# Altium schematic sheet 03_External_Storage_Interface.SchDoc: Mainboard External Storage
size A3; SheetNumber: 7; SheetTotal: 13
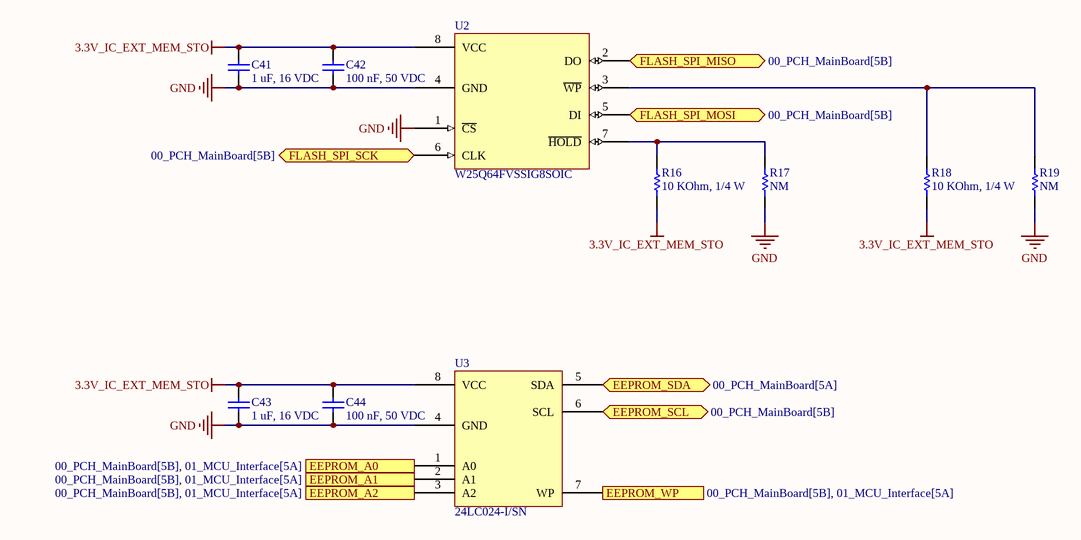
[diagram p0: 03_External_Storage_Interface.SchDoc]

## Parts
C41  1 uF, 16 VDC  [CAP_0603]
C42  100 nF, 50 VDC  [CAP_0603]
C43  1 uF, 16 VDC  [CAP_0603]
C44  100 nF, 50 VDC  [CAP_0603]
R16  10 KOhm, 1/4 W  [resistor_0603]
R17  NM  [resistor_0603]
R18  10 KOhm, 1/4 W  [resistor_0603]
R19  NM  [resistor_0603]
U2  W25Q64FVSSIG8SOIC  [W25Qxx8SOIC]
U3  24LC024-I/SN  [24LCxxx-I/SN]

## Ports
EEPROM_A0 (in, see 00_PCH_MainBoard[5B], 01_MCU_Interface[5A]), EEPROM_A1 (in, see 00_PCH_MainBoard[5B], 01_MCU_Interface[5A]), EEPROM_A2 (in, see 00_PCH_MainBoard[5B], 01_MCU_Interface[5A]), EEPROM_SCL (bidir, see 00_PCH_MainBoard[5B]), EEPROM_SDA (bidir, see 00_PCH_MainBoard[5A]), EEPROM_WP (in, see 00_PCH_MainBoard[5B], 01_MCU_Interface[5A]), FLASH_SPI_MISO (bidir, see 00_PCH_MainBoard[5B]), FLASH_SPI_MOSI (bidir, see 00_PCH_MainBoard[5B]), FLASH_SPI_SCK (bidir, see 00_PCH_MainBoard[5B])

## Nets
3.3V_IC_EXT_MEM_STO: C41.2 C42.2 C43.2 C44.2 R16.1 R18.1 U2.8(VCC) U3.8(VCC)
GND: C41.1 C42.1 C43.1 C44.1 R17.1 R19.1 U2.1(~{CS}) U2.4(GND) U3.4(GND)
EEPROM_A0: U3.1(A0) ; port EEPROM_A0
EEPROM_A1: U3.2(A1) ; port EEPROM_A1
EEPROM_A2: U3.3(A2) ; port EEPROM_A2
EEPROM_SCL: U3.6(SCL) ; port EEPROM_SCL
EEPROM_SDA: U3.5(SDA) ; port EEPROM_SDA
EEPROM_WP: U3.7(WP) ; port EEPROM_WP
FLASH_SPI_MISO: U2.2(DO) ; port FLASH_SPI_MISO
FLASH_SPI_MOSI: U2.5(DI) ; port FLASH_SPI_MOSI
FLASH_SPI_SCK: U2.6(CLK) ; port FLASH_SPI_SCK
NetR16_2: R16.2 R17.2 U2.7(~{HOLD})
NetR18_2: R18.2 R19.2 U2.3(~{WP})

## Notes on the sheet
- APPROVALS
- DATE
- PROJECT
- BOM:
- REFERENCE DOCUMENTS
- TITLE
- PROJECT REVISION
- DOCUMENT REVISION
- ASSY DWG:
- FAB DWG:
- PCB DWG:
- SIZE:
- A3
- FILE NAME:
- REV
- SHEET
- OF

## Library data of the parts
C41 C43 = 0106031051016: CAP, size 0603, 1 uF, 16 VDC; Manufacture Name: Samsung Electro-Mechanics; Manufacture SN: CL10B105KO8NNWC; Capacitance: 1 uF; Tolerance: +/-10%; Voltage Rating DC: 16 VDC; ComponentLink2Description: Datasheet; ComponentLink2URL: https://www.mouser.vn/datasheet/2/585/Samsung_MLCC_1837944-1929650.pdf; Operating Temperature: -55 to +125degC; Packaging: Tape and Reel; Mounting Technology: SMT; Size: 0603; Supplier 1 Name: Mouser; Supplier 1 SN: 187-CL10B105KO8NNWC; Supplier 1 URL: https://www.mouser.vn/ProductDetail/Samsung-Electro-Mechanics/CL10B105KO8NNWC?qs=81r%252BiQLm7BT%252BXtc72qn1ug%3D%3D&utm_source=mouser-refine-download&utm_medium=file&utm_campaign=CL10B105KO8NNWC&utm_content=Samsung-Electro-Mechanics; Supplier 2 Name: Digi-Key; Supplier 2 SN: 1276-CL10B105KO8NNWCTR-ND; Supplier 2 URL: https://www.digikey.com/en/products/detail/samsung-electro-mechanics/cl10b105ko8nnwc/16572783; Supplier 3 Name: thegioiic; Supplier 3 SN: N/A; Supplier 3 URL: https://www.thegioiic.com/tu-gom-0603-1uf-16v; Value: 1 uF, 16 VDC
C42 C44 = 0106031041050: CAP, size 0603, 100 nF, 50 VDC; Manufacture Name: TDK; Manufacture SN: CGA3E3X8R1H104K080AE; Capacitance: 100 nF; Tolerance: +/-10%; Voltage Rating DC: 50 VDC; ComponentLink2Description: Datasheet; ComponentLink2URL: https://product.tdk.com/system/files/dam/doc/product/capacitor/ceramic/mlcc/catalog/mlcc_automotive_soft_en.pdf?ref_disty=mouser; Operating Temperature: -55 to +125degC; Packaging: Tape and Reel; Mounting Technology: SMT; Size: 0603; Supplier 1 Name: Mouser; Supplier 1 SN: 810-CGA3E3X8R1H104KA; Supplier 1 URL: https://www.mouser.com/ProductDetail/TDK/CGA3E3X8R1H104K080AE?qs=nQSIdc08i%252Bd8g3IRRgU2bw%3D%3D&utm_source=mouser-refine-download&utm_medium=file&utm_campaign=CGA3E3X8R1H104K080AE&utm_content=TDK; Supplier 2 Name: Digi-Key; Supplier 2 SN: 445-173697-2-ND; Supplier 2 URL: https://www.digikey.com/en/products/detail/tdk-corporation/cga3e3x8r1h104k080ae/5809262; Supplier 3 Name: thegioiic; Supplier 3 SN: N/A; Supplier 3 URL: N/A; Value: 100 nF, 50 VDC
R16 R18 = 0006031031: RES, size 0603, 10 KOhm, 1/4 W; Manufacture  Name: OEM; Resistance: 10 KOhm; Rated Power: 1/4 W; Resistance Tolerance: +/-1%; Size: 0603; Mounting Technology: SMT; Supplier 1 Name: Mouser; Supplier 1 SN: 755-ESR03EZPF1002; Supplier 2 Name: Digi-Key; Supplier 2 SN: RHM10KADTR-ND RHM10KADCT-ND RHM10KADDKR-ND; Supplier 1 URL: https://www.mouser.vn/ProductDetail/ROHM-Semiconductor/ESR03EZPF1002?qs=sGAEpiMZZMvdGkrng054t67Efho1F8r6CDeAsqwFse8%3D; Supplier 3 Name: thegioiic; Supplier 3 SN: N/A; Supplier 3 URL: N/A; Manufacture  SN: OEM; Value: 10 KOhm, 1/4 W; ComponentLink1Description: Datasheet link; ComponentLink1URL: https://fscdn.rohm.com/en/products/databook/datasheet/passive/resistor/chip_resistor/esr-e.pdf; ComponentLink2Description: Supplier 1 URL; ComponentLink2URL: N/A; ComponentLink3Description: Supplier 2 URL; ComponentLink3URL: https://www.digikey.com/en/products/detail/rohm-semiconductor/ESR03EZPF1002/1983429; ComponentLink4Description: Supplier 3 URL; ComponentLink4URL: N/A; Supplier 2 URL: https://www.digikey.com/en/products/detail/rohm-semiconductor/ESR03EZPF1002/1983429
R17 R19 = 000603_NM: RES, size 0603, NM; Resistance: NM; Size: 0603; Rated Power: N/A; Mounting Technology: SMT; Supplier 1 Name: Mouser; Supplier 1 SN: N/A; Supplier 2 Name: Digi-Key; Supplier 2 SN: N/A; Supplier 1 URL: N/A; Supplier 3 Name: thegioiic; Supplier 3 SN: N/A; Supplier 3 URL: N/A; Manufacture  Name: N/A; Manufacture  SN: N/A; Value: NM; ComponentLink1Description: Datasheet link; ComponentLink1URL: N/A; ComponentLink2Description: Supplier 1 URL; ComponentLink2URL: N/A; ComponentLink3Description: Supplier 2 URL; ComponentLink3URL: N/A; ComponentLink4Description: Supplier 3 URL; ComponentLink4URL: N/A; Resistance Tolerance: N/A; Supplier 2 URL: N/A
U2 = W25Q64FVSSIG8SOIC: IC FLASH 64MBIT SPI/QUAD 8SOIC; Manufacturer: Winbond Electronics; Supply Voltage: 2.7 V - 3.6 V; Active Read Current - Max: 4 mA; Interface Type: SPI - Quad I/O, QPI; Maximum Clock Frequency: 416 MHz; Data Bus Width: 8 bit; IC Name: W25Q64FVSSIG; Mounting Style: SMD/SMT; Package: 8SOIC; Memory Size: 64 Mbit; ComponentLink1Description: Datasheet link; ComponentLink1URL: https://www.winbond.com/resource-files/w25q64fv%20revs%2007182017.pdf; ComponentLink2Description: Supplier 1 URL; ComponentLink2URL: https://www.mouser.vn/ProductDetail/Winbond/W25Q64FVSSIG?qs=rkhjVJ6%2F3EIyeN0wt4XchA%3D%3D; ComponentLink3Description: Supplier 2 URL; ComponentLink3URL: https://www.digikey.com/en/products/detail/winbond-electronics/W25Q64FVSSIG/2815931; ComponentLink4Description: Supplier 3 URL; ComponentLink4URL: https://www.thegioiic.com/w25q64fvssig-ic-nho-nor-flash-64mbit-8-soic; Supplier 1 Name: Mouser; Supplier 1 SN: N/A; Supplier 1 URL: https://www.mouser.vn/ProductDetail/Winbond/W25Q64FVSSIG?qs=rkhjVJ6%2F3EIyeN0wt4XchA%3D%3D; Supplier 2 Name: Digi-Key; Supplier 2 SN: W25Q64FVSSIG-ND; Supplier 2 URL: https://www.digikey.com/en/products/detail/winbond-electronics/W25Q64FVSSIG/2815931; Supplier 3 Name: thegioiic; Supplier 3 SN: N/A; Supplier 3 URL: https://www.thegioiic.com/w25q64fvssig-ic-nho-nor-flash-64mbit-8-soic; Value: W25Q64FVSSIG8SOIC
U3 = 24LC024-I/SN: 2 Kbit Electrically Erasable PROM; Manufacturer: Microchip; Interface Type: 2-Wire, I2C; Maximum Clock Frequency: 400 kHz; Memory Size: 2 kbit; Supply Voltage: 2.5 V - 5.5 V; ComponentLink1Description: Datasheet link; ComponentLink1URL: https://www.mouser.vn/datasheet/2/268/24AA024_24LC024_24AA025_24LC025_2_Kbit_I2C_Serial_-3005761.pdf; ComponentLink2Description: Supplier 1 URL; ComponentLink2URL: https://www.mouser.vn/ProductDetail/Microchip-Technology/24LC024-I-SN?qs=qEm8%2FJMJY4oS3QxbKWHseA%3D%3D; ComponentLink3Description: Supplier 2 URL; ComponentLink3URL: https://www.digikey.com/en/products/detail/microchip-technology/24lc024-i-sn/318656; ComponentLink4Description: Supplier 3 URL; ComponentLink4URL: https://www.thegioiic.com/24lc024-i-sn-ic-eeprom-2kbit-8-soic; IC Name: 24LC024-I/SN; Mounting Style: SMD/SMT; Package: SOIC-8; Supplier 1 Name: Mouser; Supplier 1 SN: 579-24LC024-I/SN; Supplier 1 URL: https://www.mouser.vn/ProductDetail/Microchip-Technology/24LC024-I-SN?qs=qEm8%2FJMJY4oS3QxbKWHseA%3D%3D; Supplier 2 Name: Digi-Key; Supplier 2 SN: 24LC024-I/SN-ND; Supplier 2 URL: https://www.digikey.com/en/products/detail/microchip-technology/24lc024-i-sn/318656; Supplier 3 Name: thegioiic; Supplier 3 SN: N/A; Supplier 3 URL: https://www.thegioiic.com/24lc024-i-sn-ic-eeprom-2kbit-8-soic; Value: 24LC024-I/SN